# EAGLE design 8relais (EAGLE 4.16)
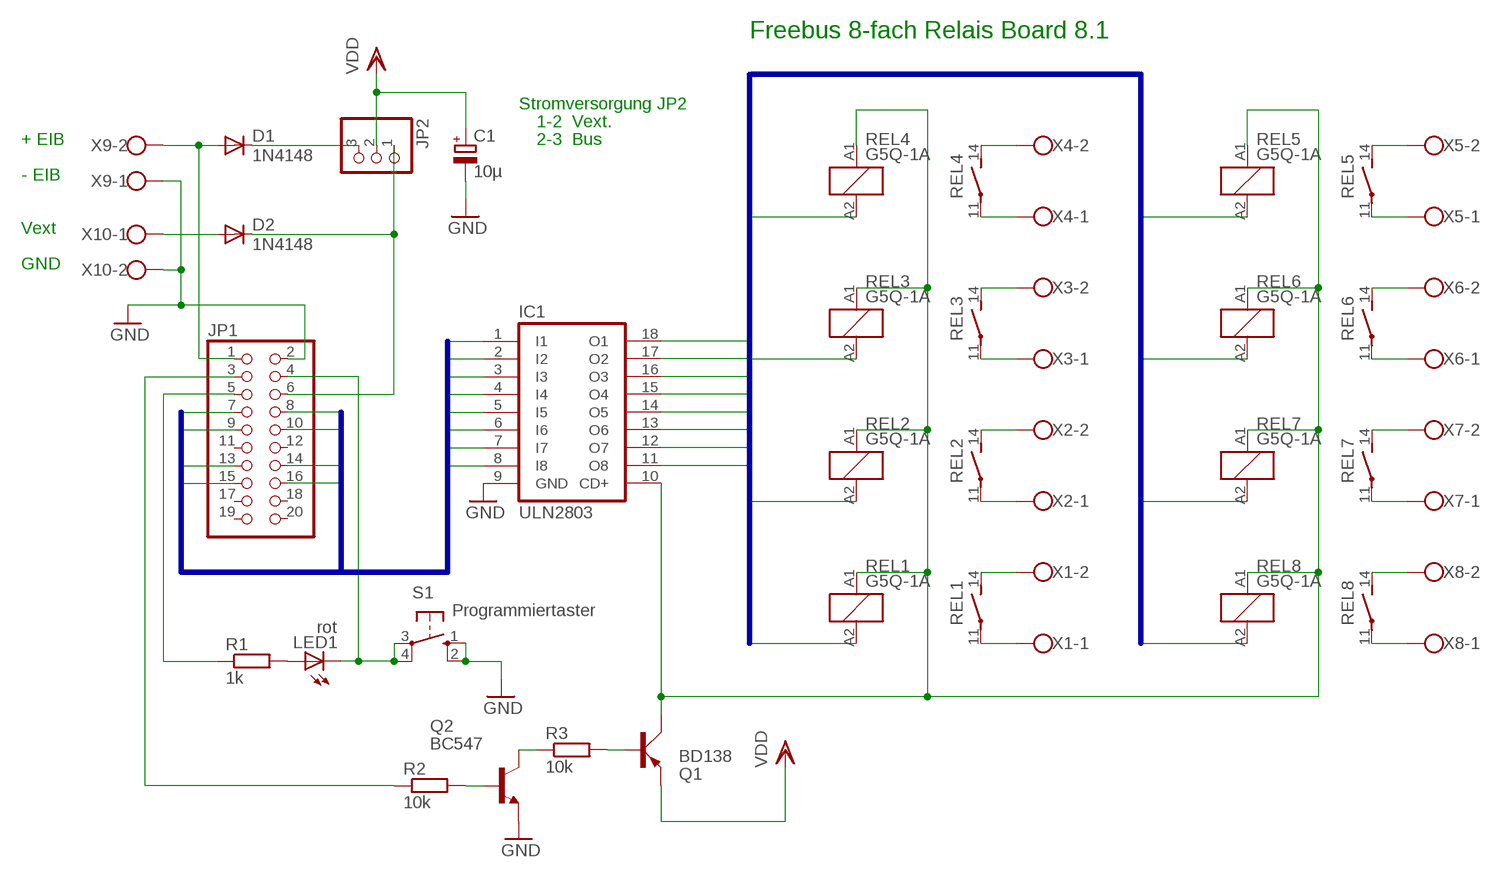
[diagram p0: schematic, sheet 1]

## Parts
C1  10µ  CPOL-EUE3.5-8  [E3,5-8]
D1  1N4148  [DO35-10]
D2  1N4148  [DO35-10]
IC1  ULN2803  ULN2803A  [DIL18]
JP1  PINHD-2X10  [2X10]
JP2  PINHD-1X3  [1X03]
LED1  rot  LED3MM  [LED3MM]
Q1  BD138  BD140  [TO126AV]
Q2  BC547  [TO92]
R1  1k  R-EU_0207/10  [0207/10]
R2  10k  R-EU_0207/10  [0207/10]
R3  10k  R-EU_0207/10  [0207/10]
REL1  G5Q-1A  RE030024  [RE-SCHRACK]
REL2  G5Q-1A  RE030024  [RE-SCHRACK]
REL3  G5Q-1A  RE030024  [RE-SCHRACK]
REL4  G5Q-1A  RE030024  [RE-SCHRACK]
REL5  G5Q-1A  RE030024  [RE-SCHRACK]
REL6  G5Q-1A  RE030024  [RE-SCHRACK]
REL7  G5Q-1A  RE030024  [RE-SCHRACK]
REL8  G5Q-1A  RE030024  [RE-SCHRACK]
S1  Programmiertaster  10-XX  [B3F-10XX]
X1  W237-102  [W237-102]
X2  W237-102  [W237-102]
X3  W237-102  [W237-102]
X4  W237-102  [W237-102]
X5  W237-102  [W237-102]
X6  W237-102  [W237-102]
X7  W237-102  [W237-102]
X8  W237-102  [W237-102]
X9  W237-102  [W237-102]
X10  W237-102  [W237-102]

## Nets
GND: C1.- IC1.9(GND) JP1.2 Q2.1(E) S1.1(S) S1.2(S1) X9.1 X10.2
IO1: IC1.1(I1) JP1.16
IO2: IC1.2(I2) JP1.15
IO3: IC1.3(I3) JP1.14
IO4: IC1.4(I4) JP1.13
IO5: IC1.5(I5) JP1.10
IO6: IC1.6(I6) JP1.9
IO7: IC1.7(I7) JP1.8
IO8: IC1.8(I8) JP1.7
N$1: REL4.11(2:P) X4.1
N$2: REL4.14(2:S) X4.2
N$3: REL3.11(2:P) X3.1
N$4: REL3.14(2:S) X3.2
N$5: REL2.11(2:P) X2.1
N$6: REL2.14(2:S) X2.2
N$7: REL1.11(2:P) X1.1
N$8: REL1.14(2:S) X1.2
N$9: REL5.11(2:P) X5.1
N$10: REL6.11(2:P) X6.1
N$11: REL7.11(2:P) X7.1
N$12: REL8.11(2:P) X8.1
N$13: REL5.14(2:S) X5.2
N$14: REL6.14(2:S) X6.2
N$15: REL7.14(2:S) X7.2
N$16: REL8.14(2:S) X8.2
N$17: D2.A X10.1
N$19: IC1.10(CD+) Q1.C REL1.A1 REL2.A1 REL3.A1 REL4.A1 REL5.A1 REL6.A1 REL7.A1 REL8.A1
N$20: D1.A JP1.1 X9.2
N$24: JP1.5 R1.1
N$27: JP1.4 LED1.K(C) S1.3(P) S1.4(P1)
N$28: LED1.A R1.2
N$31: D2.C JP1.6 JP2.1
N$32: D1.C JP2.3
N$33: JP1.3 R2.1
N$37: Q1.B R3.2
N$38: Q2.3(C) R3.1
N$39: Q2.2(B) R2.2
R1: IC1.14(O5) REL4.A2
R2: IC1.13(O6) REL3.A2
R3: IC1.12(O7) REL2.A2
R4: IC1.11(O8) REL1.A2
R5: IC1.15(O4) REL5.A2
R6: IC1.16(O3) REL6.A2
R7: IC1.17(O2) REL7.A2
R8: IC1.18(O1) REL8.A2
VDD: C1.+ JP2.2 Q1.E
Unconnected: JP1.11 JP1.12 JP1.17 JP1.18 JP1.19 JP1.20

## Buses
R[1..8]
IO[1..8]

## Notes on the sheet
- Freebus 8-fach Relais Board 8.1
- Stromversorgung JP2
- 1-2  Vext.
- + EIB | 2-3  Bus
- - EIB
- Vext
- GND

## Library data of the parts
C1 = rcl:CPOL-EU: POLARIZED CAPACITOR, European symbol
D1 D2 = diode:1N4148: DIODE high speed (Philips)
IC1 = uln-udn:ULN2803A: DRIVER ARRAY
JP1 = pinhead:PINHD-2X10: PIN HEADER
JP2 = pinhead:PINHD-1X3: PIN HEADER
LED1 = led:LED: LED OSRAM: - CHIPLED LG R971, LG N971, LY N971, LG Q971, LY Q971, LO R971, LY R971 LH N974, LH R974 LS Q976, LO Q976, LY Q976 LO Q996 - Hyper CHIPLED LW Q18S LB Q993, LB Q99A, LB R99A - SideLED LS A670, LO A670, LY A670, LG A670, LP A670 LB A673, LV A673, LT A673, LW A673 LH A674 LY A675 LS A676, LA A676, LO A676, LY A676, LW A676 LS A679, LY A679, LG A679 - Hyper Micro SIDELED® LS Y876, LA Y876, LO Y876, LY Y876 LT Y87S - SmartLED LW L88C, LW L88S LB L89C, LB L89S, LG L890 LS L89K, LO L89K, LY L89K LS L896, LA L896, LO L896, LY L896 - TOPLED LS T670, LO T670, LY T670, LG T670, LP T670 LSG T670, LSP T670, LSY T670, LOP T670, LYG T670 LG T671, LOG T671, LSG T671 LB T673, LV T673, LT T673, LW T673 LH T674 LS T676, LA T676, LO T676, LY T676, LB T676, LH T676, LSB T676, LW T676 LB T67C, LV T67C, LT T67C, LS T67K, LO T67K, LY T67K, LW E67C LS E67B, LA E67B, LO E67B, LY E67B, LB E67C, LV E67C, LT E67C LW T67C LS T679, LY T679, LG T679 LS T770, LO T770, LY T770, LG T770, LP T770 LB T773, LV T773, LT T773, LW T773 LH T774 LS E675, LA E675, LY E675, LS T675 LS T776, LA T776, LO T776, LY T776, LB T776 LHGB T686 LT T68C, LB T68C - Hyper Mini TOPLED® LB M676 - Mini TOPLED Santana® LG M470 LS M47K, LO M47K, LY M47K Source: http://www.osram.convergy.de - LUMILED® LXK2-PW12-R00, LXK2-PW12-S00, LXK2-PW14-U00, LXK2-PW14-V00 LXK2-PM12-R00, LXK2-PM12-S00, LXK2-PM14-U00 LXK2-PE12-Q00, LXK2-PE12-R00, LXK2-PE12-S00, LXK2-PE14-T00, LXK2-PE14-U00 LXK2-PB12-K00, LXK2-PB12-L00, LXK2-PB12-M00, LXK2-PB14-N00, LXK2-PB14-P00, LXK2-PB14-Q00 LXK2-PR12-L00, LXK2-PR12-M00, LXK2-PR14-Q00, LXK2-PR14-R00 LXK2-PD12-Q00, LXK2-PD12-R00, LXK2-PD12-S00 LXK2-PH12-R00, LXK2-PH12-S00 LXK2-PL12-P00, LXK2-PL12-Q00, LXK2-PL12-R00 Source: www.luxeon.com
Q1 = transistor-power:BD140: PNP TRANSISTOR
Q2 = transistor-npn:BC547*: NPN Transistor
R1-R3 = rcl:R-EU_: RESISTOR, European symbol
REL1-REL8 = relay:RE03*: Miniature PCB Relay 1 pole 6 A SCHRACK Source: http://www.schrack.com/.. 5812.pdf
S1 = switch-omron:10-XX: OMRON SWITCH
X1-X10 = con-wago-500:W237-102: WAGO SCREW CLAMP

## Board
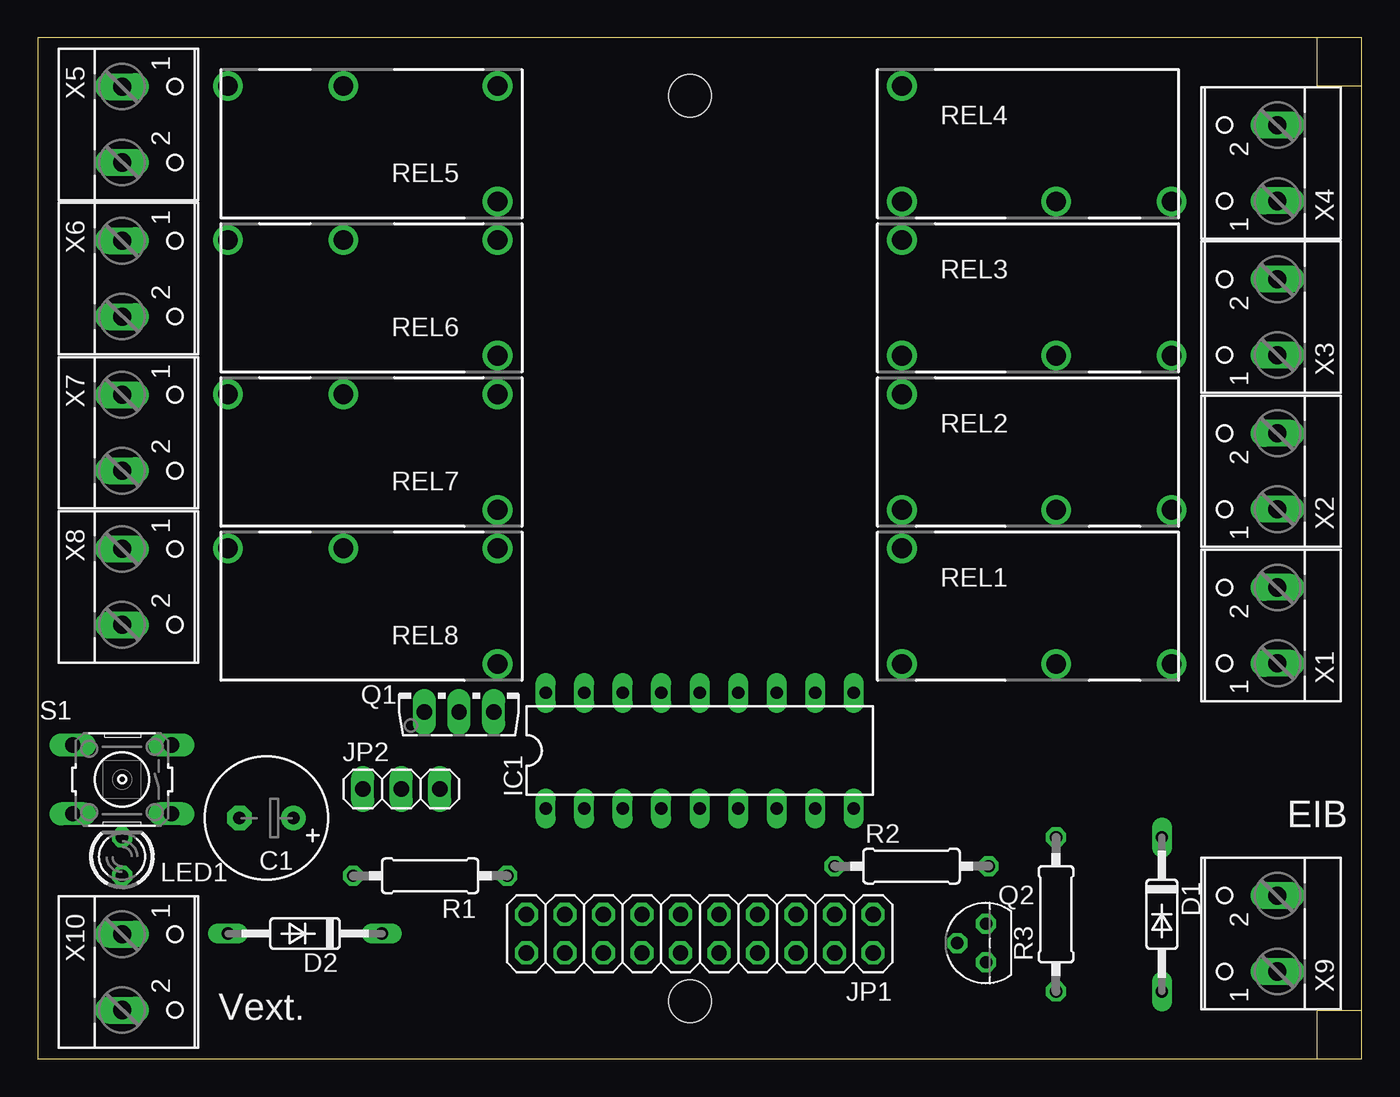
[diagram p1: board, top side]
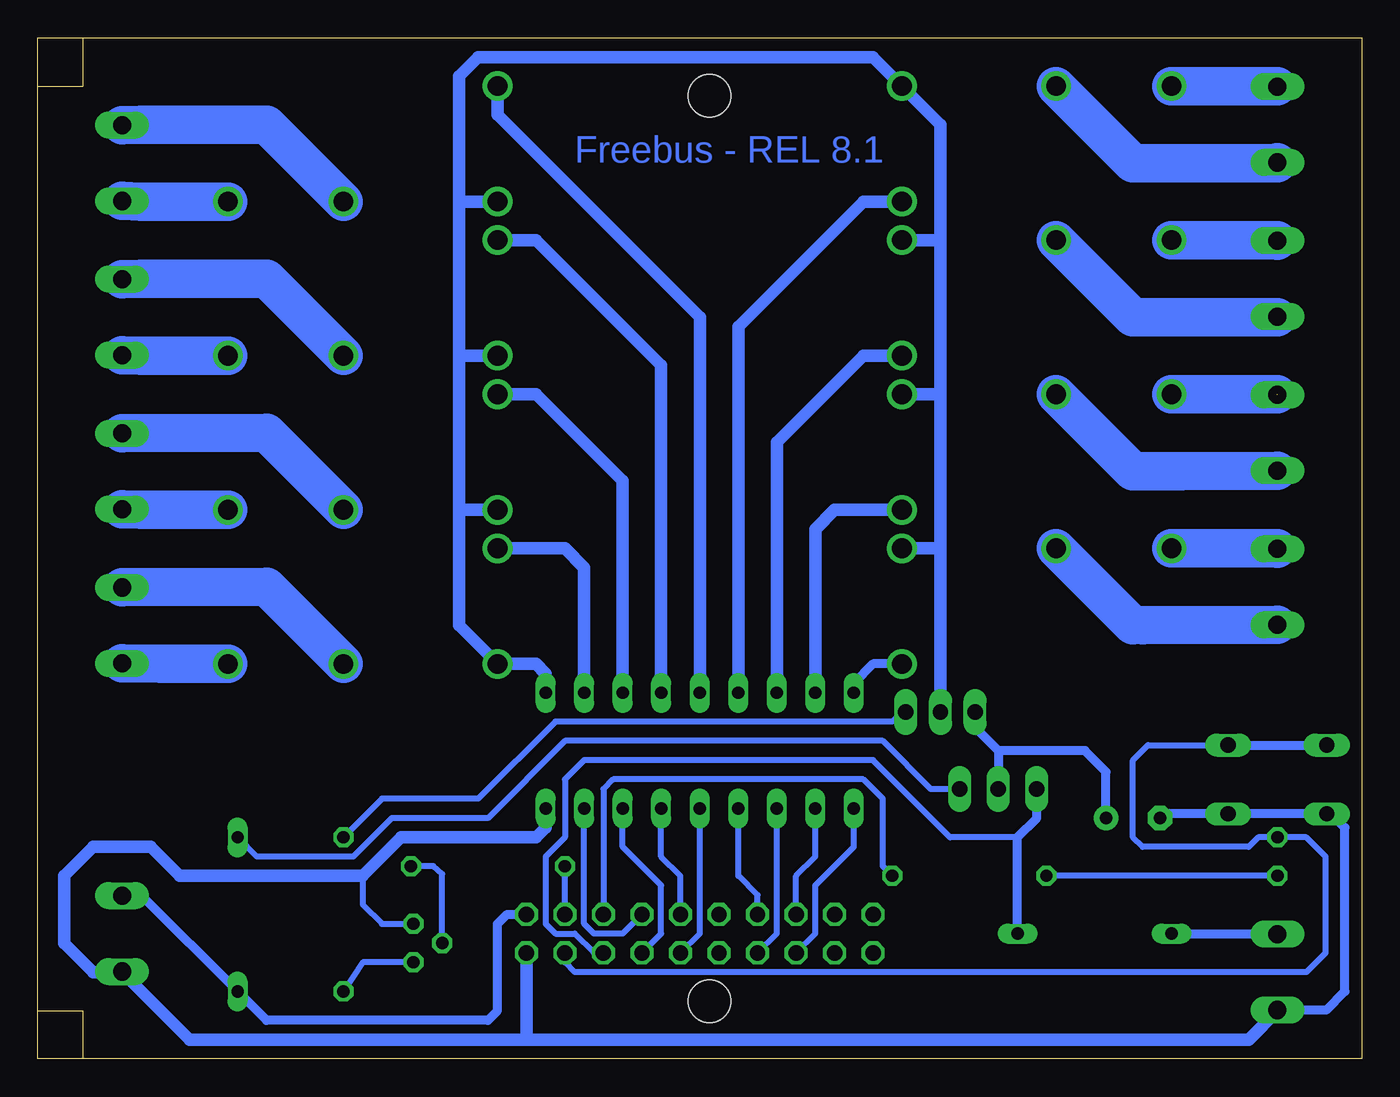
[diagram p2: board, bottom side, seen from below]

Size 87.3 x 67.3 mm. Coordinates in mm from the lower left corner, seen from the top.
Outline: 87.3,3.18 84.33,3.18 84.33,0
Outline: 84.33,0 84.33,0
Outline: 84.34,67.3 84.34,64.12
Outline: 87.3,64.13 84.33,64.13
Outline: 0,0 87.3,0 87.3,67.3 0,67.3 0,0
Copper layers (1*16): Top 0.035mm / dielectric 1.5mm / Bottom 0.035mm
Design rules "default": minimum track width 10mil, minimum drill 24mil, track to track 16mil, track to pad 12mil, pad to pad 16mil, via to via 16mil, smd to smd 8mil, copper to edge 20mil, drill to drill 10mil, minimum pad ring 10mil, minimum via ring 8mil, stop-mask expansion 4mil, vias tented up to drill 0mil, thermal gap 10mil
Holes 2.8 mm at 43.02,3.8 43.02,63.5

### Footprints (pad centres in the part's own frame; a part is rotated, then mirrored left to right if it is on the bottom)
E3,5-8 = drill 0.813 pad 1.6 round: + -1.778,0 | drill 0.813 pad 1.6 octagon: - 1.778,0
DO35-10 = drill 0.813 long: A 5.08,0; C -5.08,0
DIL18 = drill 0.813 long: 1 -10.16,-3.81; 2 -7.62,-3.81; 3 -5.08,-3.81; 4 -2.54,-3.81; 5 0,-3.81; 6 2.54,-3.81; 7 5.08,-3.81; 8 7.62,-3.81; 9 10.16,-3.81; 10 10.16,3.81; 11 7.62,3.81; 12 5.08,3.81; 13 2.54,3.81; 14 0,3.81; 15 -2.54,3.81; 16 -5.08,3.81; 17 -7.62,3.81; 18 -10.16,3.81
2X10 = drill 1.016 octagon: 1 -11.43,-1.27; 2 -11.43,1.27; 3 -8.89,-1.27; 4 -8.89,1.27; 5 -6.35,-1.27; 6 -6.35,1.27; 7 -3.81,-1.27; 8 -3.81,1.27; 9 -1.27,-1.27; 10 -1.27,1.27; 11 1.27,-1.27; 12 1.27,1.27; 13 3.81,-1.27; 14 3.81,1.27; 15 6.35,-1.27; 16 6.35,1.27; 17 8.89,-1.27; 18 8.89,1.27; 19 11.43,-1.27; 20 11.43,1.27
1X03 = drill 1.016 long: 1 -2.54,0; 2 0,0; 3 2.54,0
LED3MM = drill 0.813 octagon: A -1.27,0; K 1.27,0
TO126AV = drill 1.016 long: B 2.286,-1.27; C 0,-1.27; E -2.286,-1.27
TO92 = drill 0.813 octagon: 1 1.27,0; 2 0,1.905; 3 -1.27,0
0207/10 = drill 0.813 octagon: 1 -5.08,0; 2 5.08,0
RE-SCHRACK = drill 1.3 round: 11 8.89,-3.81; 14 1.27,-3.81; A1 -8.89,-3.81; A2 -8.89,3.81
B3F-10XX = drill 1.016 long: 1 -3.251,2.261; 2 3.251,2.261; 3 -3.251,-2.261; 4 3.251,-2.261
W237-102 = drill 1.194 long: 1 -2.5,-1.27; 2 2.5,-1.27

### Placement (x,y rotation side)
C1  15.08,15.87 180 top
D1  74.13,9.52 270 top
D2  17.61,8.25 180 top
IC1  43.65,20.31 0 top
JP1  43.65,8.25 180 top
JP2  23.96,17.77 0 top
LED1  5.55,13.33 90 top
Q1  27.77,24.12 0 top
Q2  62.54,7.63 90 top
R1  25.87,12.06 180 top
R2  57.62,12.7 0 top
R3  67.14,9.52 90 top
REL1  65.88,29.84 0 top
REL2  65.88,40 0 top
REL3  65.88,50.16 0 top
REL4  65.88,60.32 0 top
REL5  21.42,60.32 180 top
REL6  21.42,50.16 180 top
REL7  21.42,40 180 top
REL8  21.42,29.84 180 top
S1  5.55,18.41 180 top
X1  80.48,28.57 90 top
X2  80.48,38.73 90 top
X3  80.48,48.89 90 top
X4  80.48,59.05 90 top
X5  6.82,61.59 270 top
X6  6.82,51.43 270 top
X7  6.82,41.27 270 top
X8  6.82,31.11 270 top
X9  80.48,8.25 90 top
X10  6.82,5.71 270 top

### Tracks (layer width: path | path; a pad name or v marks a point on that pad's centre or on a via)
GND
  Bottom 0.254: 5.55,3.17 X10.2 | 81.75,5.71 X9.1
  Bottom 0.406: 3.29,16.15 3.01,15.87 2.73,16.15 S1.2 | Q2.1 64.61,8.89 65.88,10.16 65.88,12.06
  Bottom 0.61: 5.51,3.21 2.33,3.21 1.1,4.44 1.1,15.24 2.02,16.15 S1.2 | 3.29,16.15 S1.1 12.89,16.15 13.17,15.87 C1.-
  Bottom 0.813: 5.51,3.21 5.55,3.17 7.46,1.27 55.08,1.27 | 55.08,1.27 77.3,1.27 81.75,5.71 83.66,5.71 85.56,7.62 85.56,12.06 83.66,13.97 79.84,13.97 77.94,12.06 65.88,12.06 63.34,14.6 54.45,14.6 53.81,15.24 IC1.9 | 55.08,1.27 JP1.2
IO1
  Bottom 0.406: IC1.1 33.49,13.97 36.03,11.43 36.03,8.25 JP1.16
IO2
  Bottom 0.406: JP1.15 37.3,12.06 36.03,13.33 IC1.2
IO3
  Bottom 0.406: IC1.3 38.57,8.25 JP1.14
IO4
  Bottom 0.406: JP1.13 39.84,10.79 41.11,12.06 IC1.4
IO5
  Bottom 0.406: IC1.5 43.65,8.25 JP1.10
IO6
  Bottom 0.406: JP1.9 44.92,12.06 46.19,13.33 IC1.6
IO7
  Bottom 0.406: IC1.7 48.73,13.97 46.19,11.43 46.19,8.25 JP1.8
IO8
  Bottom 0.406: JP1.7 48.73,8.25 50.63,8.25 51.27,8.89 IC1.8
N$1
  Bottom 2.54: X4.1 80.48,56.51 REL4.11
N$2
  Bottom 2.54: REL4.14 72.22,61.59 80.48,61.59 X4.2
N$3
  Bottom 2.54: X3.1 80.48,46.35 REL3.11
N$4
  Bottom 2.54: REL3.14 72.22,51.43 80.48,51.43 X3.2
N$5
  Bottom 2.54: X2.1 80.48,36.19 REL2.11
N$6
  Bottom 2.54: X2.2 72.22,41.27 REL2.14
N$7
  Bottom 2.54: X1.1 79.21,26.03 REL1.11
N$8
  Bottom 2.54: X1.2 72.22,31.11 REL1.14
N$9
  Bottom 1.778: X5.1 5.55,64.13
  Bottom 2.54: 5.55,64.13 REL5.11
N$10
  Bottom 2.54: X6.1 5.55,53.97 REL6.11
N$11  (1 unrouted)
  Bottom 2.54: 5.55,43.81 REL7.11
N$12
  Bottom 2.54: REL8.11 5.55,33.65 X8.1
N$13
  Bottom 2.54: REL5.14 15.08,59.05 5.55,59.05 X5.2
N$14
  Bottom 1.778: X6.2 5.55,48.89
  Bottom 2.54: REL6.14 15.08,48.89 5.55,48.89
N$15
  Bottom 2.54: REL7.14 15.08,38.73 11.9,38.73 X7.2
N$16
  Bottom 1.778: 14.44,28.57 15.08,28.57
  Bottom 2.54: 15.08,28.57 REL8.14 | X8.2 14.44,28.57
N$17
  Bottom 0.406: 12.5,8.21 D2.A
  Bottom 0.61: X10.1 12.5,8.21
N$19
  Bottom 0.813: 27.77,33.65 REL8.A1 | 27.77,33.65 27.77,43.81 | 27.77,43.81 REL7.A1 | 27.77,43.81 27.77,53.97 | 27.77,53.97 REL6.A1 | 27.77,53.97 27.77,61.59 REL5.A1 32.22,66.03 58.25,66.03 59.52,64.77 59.52,56.51 | 59.52,56.51 59.52,46.35 | 59.52,46.35 59.52,36.19 | 59.52,36.19 59.52,28.57 REL1.A1 54.45,26.03 53.81,25.39 IC1.10 | 59.52,36.19 REL2.A1 | 59.52,46.35 REL3.A1 | 59.52,56.51 REL4.A1 | Q1.C 27.77,33.65
N$20
  Bottom 0.61: X9.2 80.44,10.75 D1.A 72.22,2.54 57.62,2.54 56.98,3.17 56.98,8.89 56.35,9.52 JP1.1
N$24
  Bottom 0.406: JP1.5 50,17.77 49.37,18.41 32.85,18.41 31.58,17.14 31.58,12.7 R1.1
N$27
  Bottom 0.406: JP1.4 52.54,6.34 51.91,5.71 3.64,5.71 2.38,6.98 2.38,13.33 3.64,14.6 LED1.K 6.82,14.6 7.46,13.97 14.44,13.97 15.08,14.6 15.08,19.68 14.08,20.67 S1.3
  Bottom 0.61: S1.4 7.73,20.67 8.09,20.31 8.45,20.67 S1.3
N$28
  Bottom 0.406: LED1.A R1.2
N$31
  Bottom 0.406: JP1.6 50.63,6.98 51.91,8.25 53.17,8.25 53.81,8.89 53.81,13.33 52.54,14.6 52.54,18.41 51.27,19.68 32.22,19.68 27.14,14.6 22.7,14.6
  Bottom 0.61: JP2.1 21.42,15.87 22.7,14.6 D2.C
N$32
  Bottom 0.406: D1.C 72.86,13.33 66.51,13.33 63.97,15.87 57.62,15.87 52.54,20.95 31.58,20.95 28.41,17.77 JP2.3
N$33
  Bottom 0.406: JP1.3 R2.1
N$37
  Bottom 0.406: R3.2 64.61,17.14 58.25,17.14 53.17,22.22 30.95,22.22 30.31,22.86 Q1.B
N$38
  Bottom 0.406: Q2.3 65.88,6.34 R3.1
N$39
  Bottom 0.406: R2.2 61.22,12.7 60.64,12.19 Q2.2
R1
  Bottom 0.813: REL4.A2 56.98,62.23 43.65,48.89 IC1.14
R2
  Bottom 0.813: REL3.A2 54.45,53.97 46.19,45.72 IC1.13
R3
  Bottom 0.813: REL2.A2 54.45,43.81 48.73,38.1 IC1.12
R4
  Bottom 0.813: REL1.A2 52.54,33.65 51.27,32.38 IC1.11
R5
  Bottom 0.813: REL5.A2 32.85,56.51 41.11,48.26 IC1.15
R6
  Bottom 0.813: REL6.A2 32.85,46.35 38.57,40.64 IC1.16
R7
  Bottom 0.813: REL7.A2 34.76,36.19 36.03,34.92 IC1.17
R8
  Bottom 0.61: IC1.18 33.49,24.76 32.22,26.03 REL8.A2
VDD
  Bottom 0.61: C1.+ 16.85,18.92 18.25,20.31 23.96,20.31 | 23.96,20.31 JP2.2 | Q1.E 25.49,21.84 23.96,20.31

### Text on the board
Bottom: Freebus - REL 8.1
tPlace: EIB | Vext.